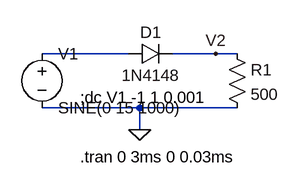
[diagram p0: schematic Diode1.asc]
Diode1.asc, the LTspice schematic file:
Version 4
SHEET 1 880 680
WIRE 176 -80 48 -80
WIRE 304 -80 240 -80
WIRE 336 -80 304 -80
WIRE 192 0 48 0
WIRE 336 0 192 0
WIRE 192 32 192 0
FLAG 192 32 0
FLAG 304 -80 V2
SYMBOL diode 176 -64 R270
WINDOW 0 32 32 VTop 2
WINDOW 3 0 32 VBottom 2
SYMATTR InstName D1
SYMATTR Value 1N4148
SYMBOL res 320 -96 R0
SYMATTR InstName R1
SYMATTR Value 500
SYMBOL voltage 48 -96 R0
WINDOW 123 0 0 Left 0
WINDOW 39 0 0 Left 0
SYMATTR InstName V1
SYMATTR Value SINE(0 15 1000)
TEXT 104 -16 Left 2 !;dc V1 -1 1 0.001
TEXT 104 72 Left 2 !.tran 0 3ms 0 0.03ms

The netlist it stands for:
* Diode1.asc
D1 N001 V2 1N4148
R1 V2 0 500
V1 N001 0 SINE(0 15 1000)
.model D D
.lib standard.dio
;dc V1 -1 1 0.001
.tran 0 3ms 0 0.03ms
.backanno
.end